# EAGLE design ColorDetection (EAGLE 6.3)
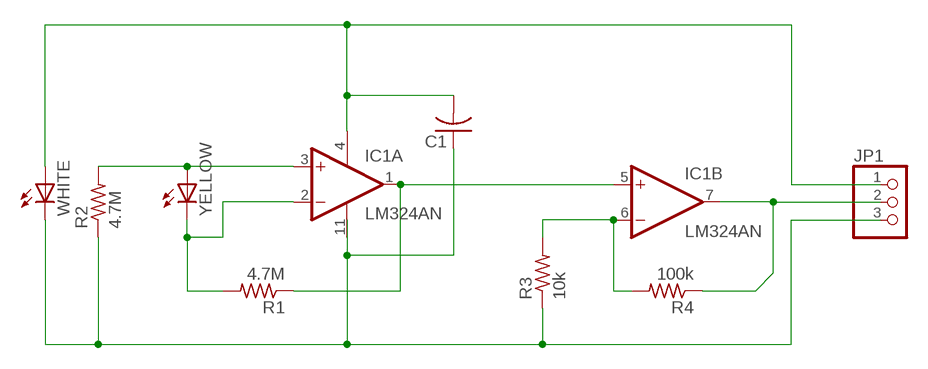
[diagram p0: schematic, sheet 1]

## Parts
C1  C-USC0805  [C0805]
IC1  LM324AN  MCP604P  [DIL14]
JP1  PINHD-1X3  [1X03]
R1  4.7M  R-US_M0805  [M0805]
R2  4.7M  R-US_M0805  [M0805]
R3  10k  R-US_M0805  [M0805]
R4  100k  R-US_M0805  [M0805]
WHITE  LED10MM  [LED10MM]
YELLOW  LED5MM  [LED5MM]

## Nets
3V3: C1.2 IC1.4(P:V+) JP1.1 WHITE.A
GND: C1.1 JP1.3 R2.1 R3.1 WHITE.K(C)
N$2: IC1.3(A:+IN) R2.2 YELLOW.A
N$3: IC1.2(A:-IN) R1.2 YELLOW.K(C)
N$4: IC1.1(A:OUT) IC1.5(B:+IN) R1.1
N$6: IC1.6(B:-IN) R3.2 R4.2
N$7: IC1.7(B:OUT) JP1.2 R4.1
Unconnected: IC1.8(C:OUT) IC1.9(C:-IN) IC1.10(C:+IN) IC1.12(D:+IN) IC1.13(D:-IN) IC1.14(D:OUT)

## Power pins joined to a net without a drawn wire
V-: IC1.11(P:V-)

## Library data of the parts
C1 = rcl:C-US: CAPACITOR, American symbol
IC1 = linear:MCP604: Quad Op Amp 2.7V to 6.0V Single Supply CMOS Source: http://ww1.microchip.com/downloads/en/DeviceDoc/21314g.pdf
JP1 = pinhead:PINHD-1X3: PIN HEADER
R1-R4 = rcl:R-US_: RESISTOR, American symbol
WHITE YELLOW = led:LED: LED OSRAM: - CHIPLED LG R971, LG N971, LY N971, LG Q971, LY Q971, LO R971, LY R971 LH N974, LH R974 LS Q976, LO Q976, LY Q976 LO Q996 - Hyper CHIPLED LW Q18S LB Q993, LB Q99A, LB R99A - SideLED LS A670, LO A670, LY A670, LG A670, LP A670 LB A673, LV A673, LT A673, LW A673 LH A674 LY A675 LS A676, LA A676, LO A676, LY A676, LW A676 LS A679, LY A679, LG A679 - Hyper Micro SIDELED® LS Y876, LA Y876, LO Y876, LY Y876 LT Y87S - SmartLED LW L88C, LW L88S LB L89C, LB L89S, LG L890 LS L89K, LO L89K, LY L89K LS L896, LA L896, LO L896, LY L896 - TOPLED LS T670, LO T670, LY T670, LG T670, LP T670 LSG T670, LSP T670, LSY T670, LOP T670, LYG T670 LG T671, LOG T671, LSG T671 LB T673, LV T673, LT T673, LW T673 LH T674 LS T676, LA T676, LO T676, LY T676, LB T676, LH T676, LSB T676, LW T676 LB T67C, LV T67C, LT T67C, LS T67K, LO T67K, LY T67K, LW E67C LS E67B, LA E67B, LO E67B, LY E67B, LB E67C, LV E67C, LT E67C LW T67C LS T679, LY T679, LG T679 LS T770, LO T770, LY T770, LG T770, LP T770 LB T773, LV T773, LT T773, LW T773 LH T774 LS E675, LA E675, LY E675, LS T675 LS T776, LA T776, LO T776, LY T776, LB T776 LHGB T686 LT T68C, LB T68C - Hyper Mini TOPLED® LB M676 - Mini TOPLED Santana® LG M470 LS M47K, LO M47K, LY M47K Source: http://www.osram.convergy.de LUXEON: - LUMILED® LXK2-PW12-R00, LXK2-PW12-S00, LXK2-PW14-U00, LXK2-PW14-V00 LXK2-PM12-R00, LXK2-PM12-S00, LXK2-PM14-U00 LXK2-PE12-Q00, LXK2-PE12-R00, LXK2-PE12-S00, LXK2-PE14-T00, LXK2-PE14-U00 LXK2-PB12-K00, LXK2-PB12-L00, LXK2-PB12-M00, LXK2-PB14-N00, LXK2-PB14-P00, LXK2-PB14-Q00 LXK2-PR12-L00, LXK2-PR12-M00, LXK2-PR14-Q00, LXK2-PR14-R00 LXK2-PD12-Q00, LXK2-PD12-R00, LXK2-PD12-S00 LXK2-PH12-R00, LXK2-PH12-S00 LXK2-PL12-P00, LXK2-PL12-Q00, LXK2-PL12-R00 Source: www.luxeon.com KINGBRIGHT: KA-3528ASYC Source: www.kingbright.com

## Board
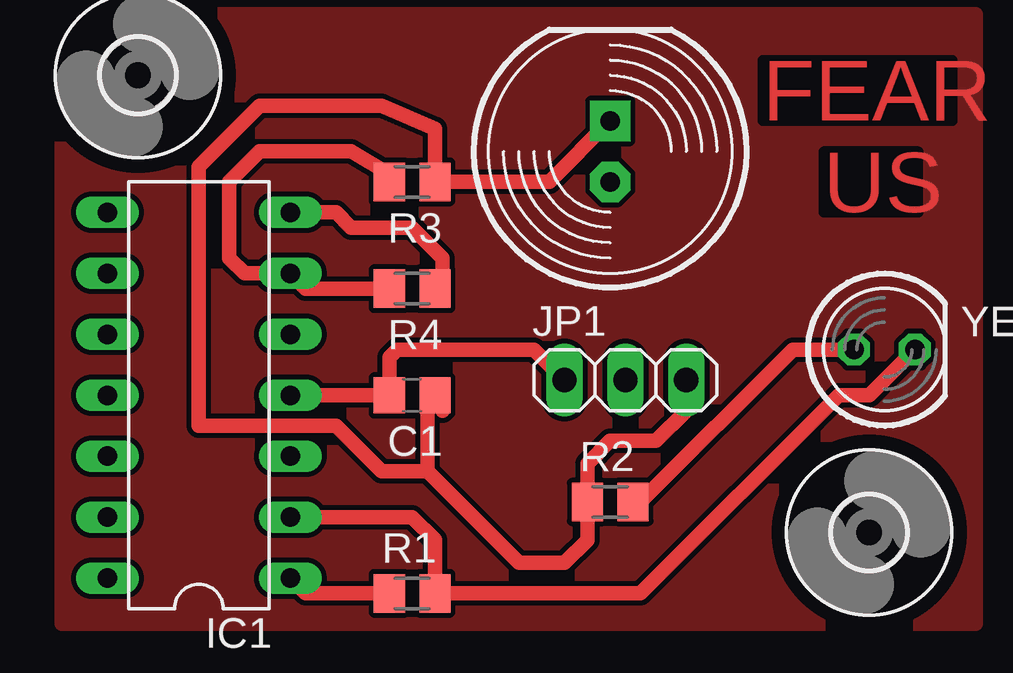
[diagram p1: board, top side]
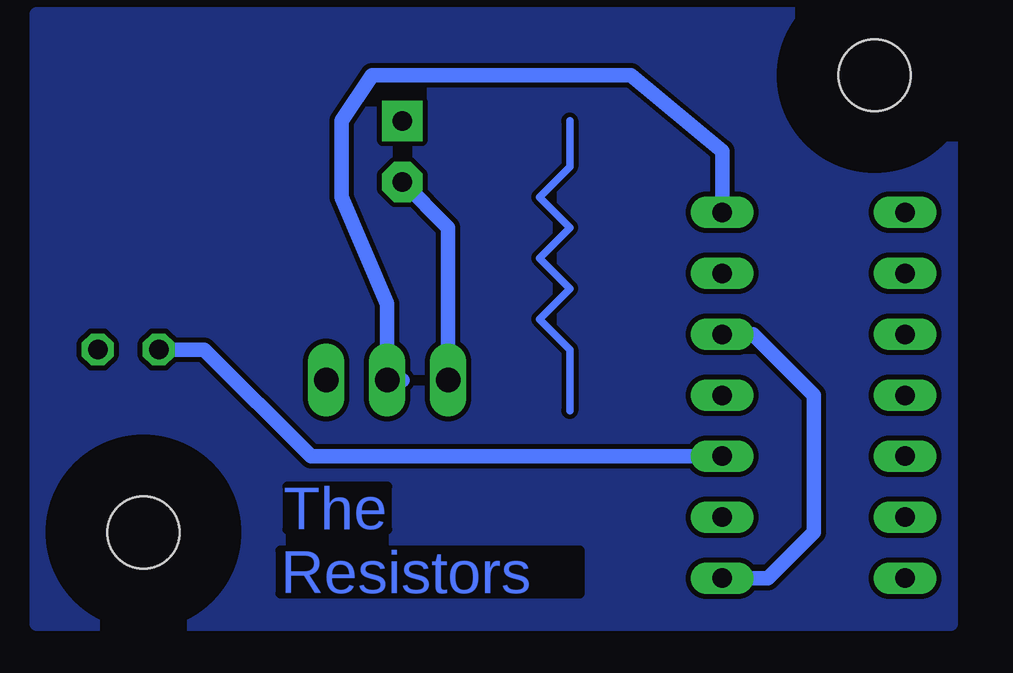
[diagram p2: board, bottom side, seen from below]

No outline drawn. Coordinates in mm, seen from the top.
Copper layers (1*16): Top 0.035mm / dielectric 1.5mm / Bottom 0.035mm
Design rules "default": minimum track width 10mil, minimum drill 24mil, track to track 8mil, track to pad 8mil, pad to pad 8mil, via to via 8mil, smd to smd 8mil, copper to edge 40mil, drill to drill 8mil, minimum pad ring 10mil, minimum via ring 8mil, stop-mask expansion 4mil, vias tented up to drill 0mil, thermal gap 10mil

### Footprints (pad centres in the part's own frame; a part is rotated, then mirrored left to right if it is on the bottom)
C0805 = smd 1.3 x 1.5: 1 -0.95,0; 2 0.95,0
DIL14 = drill 0.813 long: 1 -7.62,-3.81; 2 -5.08,-3.81; 3 -2.54,-3.81; 4 0,-3.81; 5 2.54,-3.81; 6 5.08,-3.81; 7 7.62,-3.81; 8 7.62,3.81; 9 5.08,3.81; 10 2.54,3.81; 11 0,3.81; 12 -2.54,3.81; 13 -5.08,3.81; 14 -7.62,3.81
1X03 = drill 1.016 long: 1 -2.54,0; 2 0,0; 3 2.54,0
M0805 = smd 1.3 x 1.6: 1 -0.95,0; 2 0.95,0
3,0 = hole 3: 0,0
LED10MM = drill 0.813 pad 1.676 octagon: A -1.27,0 | drill 0.813 pad 1.676 square: K 1.27,0
LED5MM = drill 0.813 octagon: A -1.27,0; K 1.27,0

### Placement (x,y rotation side)
C1  14.61,9.53 180 top
IC1  5.71,9.53 90 top
JP1  23.5,10.16 0 top
R1  14.61,1.27 0 top
R2  22.86,5.08 0 top
R3  14.61,18.41 180 top
R4  14.61,13.97 180 top
U$1  [3,0]  33.66,3.81 0 top
U$2  [3,0]  3.17,22.86 0 top
WHITE  22.86,19.68 90 top
YELLOW  34.29,11.43 0 top

### Tracks (layer width: path | path; a pad name or v marks a point on that pad's centre or on a via)
3V3
  Top 0.61: IC1.4 C1.2 13.65,11.12 13.97,11.43 19.68,11.43 JP1.1
  Bottom 0.61: JP1.1 20.95,16.51 WHITE.A
GND
  Top 0.61: WHITE.K 20.32,18.41 R3.1 15.55,20.64 13.34,21.59 8.26,21.59 5.71,19.05 5.71,8.26 11.43,8.26 13.34,6.35 15.24,6.35 | 15.88,8.89 15.88,9.21 C1.1 15.24,9.21 15.24,6.35 | 15.24,6.35 19.05,2.54 20.95,2.54 21.91,3.49 R2.1 21.91,6.67 22.86,7.62 24.77,7.62 26.04,8.89 JP1.3
N$1
  pour Top: 0,0 0,25.4 38.1,25.4 38.1,0
N$2
  Top 0.61: 23.5,5.08 R2.2 24.13,5.08 30.48,11.43 YELLOW.A
  Bottom 0.61: IC1.3 26.67,6.99 31.11,11.43 YELLOW.A
N$3
  Top 0.61: R1.2 15.55,1.59 | IC1.2 14.61,4.45 15.55,3.5 15.55,1.59 | 15.55,1.59 15.88,1.27 24.13,1.27 32.38,9.53 33.66,9.53 YELLOW.K
N$4
  Top 0.61: R1.1 10.16,1.27 IC1.1
  Bottom 0.61: IC1.1 7.62,1.91 5.71,3.81 5.71,9.53 8.26,12.06 IC1.5
N$5
  pour Bottom: 0,0 0,25.4 38.1,25.4 38.1,0
N$6
  Top 0.61: R4.2 10.16,13.97 IC1.6 | R3.2 13.65,18.73 12.06,19.68 8.26,19.68 6.99,18.41 6.99,15.24 7.62,14.61 IC1.6 | 10.16,14.61 IC1.6
N$7
  Top 0.61: IC1.7 11.43,17.14 12.06,16.51 14.61,16.51 15.88,15.24 15.88,14.29 R4.1
  Bottom 0.61: 22.86,10.16 JP1.2 23.5,13.34 25.4,17.78 25.4,20.95 24.13,22.86 13.34,22.86 9.53,19.68 IC1.7
N$8
  Bottom 0.305: 15.88,20.95 15.88,19.05 17.14,17.78 15.88,16.51 17.14,15.24 15.88,13.97 17.14,12.7 15.88,11.43 15.88,8.89

### Text on the board
Top: FEAR | US
Bottom: The | Resistors